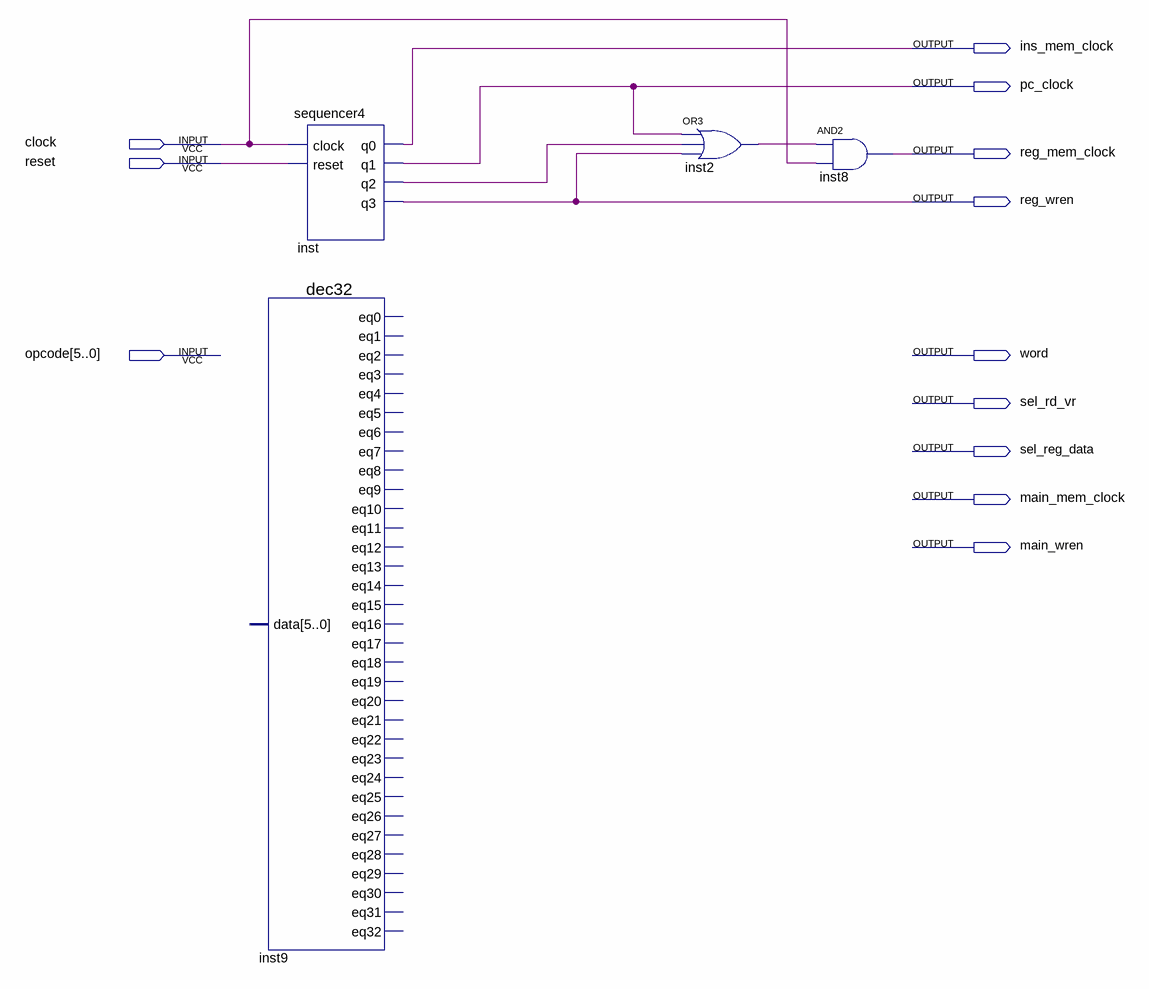
[diagram p0: schematic sheet]
// Quartus schematic CU.bdf as structural Verilog: 4 symbols, 12 pins
module CU (
  input  clock,
  input  reset,
  input  [5:0] opcode,
  output ins_mem_clock,
  output pc_clock,
  output reg_mem_clock,
  output reg_wren,
  output word,
  output sel_rd_vr,
  output sel_reg_data,
  output main_mem_clock,
  output main_wren
);

  wire inst2_out, inst_q2;

  sequencer4 inst (.clock(clock), .reset(reset), .q0(ins_mem_clock), .q1(pc_clock), .q2(inst_q2), .q3(reg_wren));
  dec32 inst9 ();  // open: data, eq0, eq1, eq2, eq3, eq4, eq5, eq6, eq7, eq8, eq9, eq10, eq11, eq12, eq13, eq14, eq15, eq16, eq17, eq18, eq19, eq20, eq21, eq22, eq23, eq24, eq25, eq26, eq27, eq28, eq29, eq30, eq31, eq32
  or inst2 (inst2_out, pc_clock, inst_q2, reg_wren);
  and inst8 (reg_mem_clock, inst2_out, clock);
endmodule
